# Altium schematic sheet Digital Port A.SchDoc: Port A Digital Control
size A4
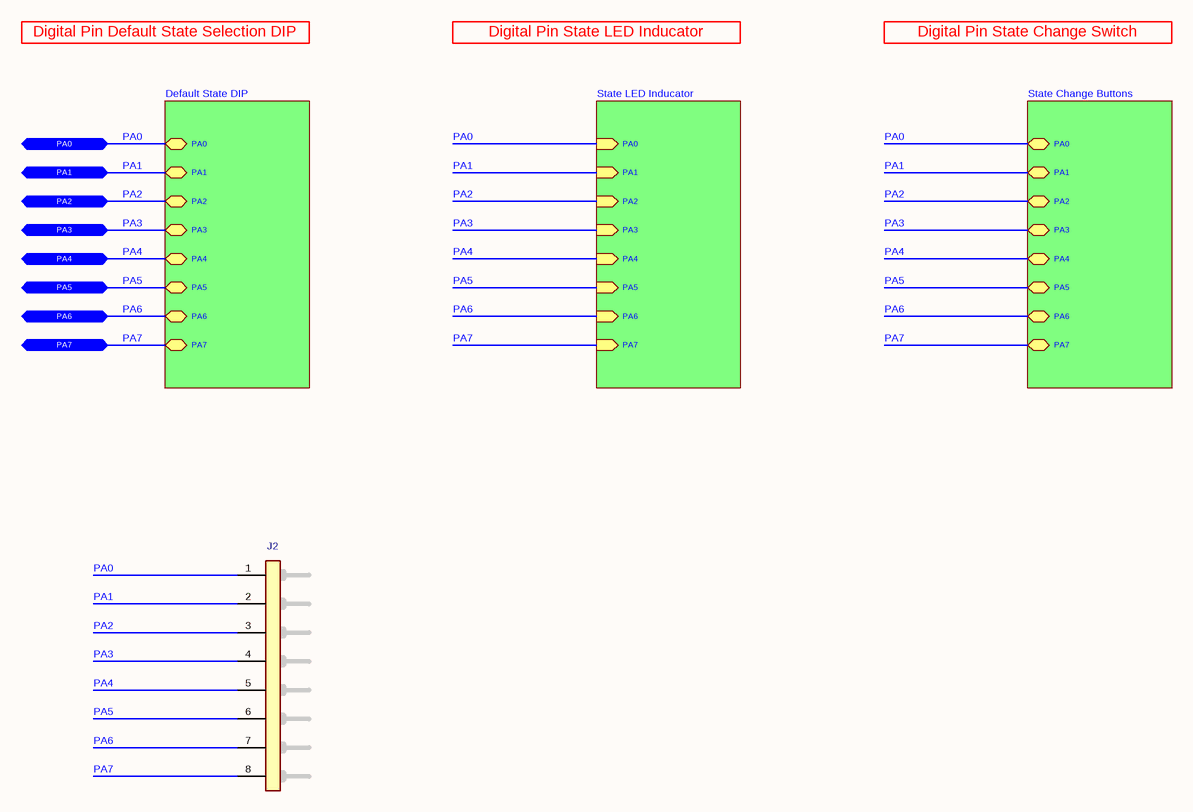
[diagram p0: Digital Port A.SchDoc]

## Parts
J2  2.54 mm Pitch 8P Male Connector  [8P Header]  (value not drawn)

## Sub-sheets
Default State DIP = Digital Port A Default State DIP.SchDoc: PA1 (bidir), PA0 (bidir), PA7 (bidir), PA4 (bidir), PA6 (bidir), PA3 (bidir), PA5 (bidir), PA2 (bidir)
State Change Buttons = Digital Port A Button.SchDoc: PA1 (bidir), PA0 (bidir), PA7 (bidir), PA4 (bidir), PA6 (bidir), PA3 (bidir), PA5 (bidir), PA2 (bidir)
State LED Inducator = Digital Port A State LED Inducator.SchDoc: PA1 (in), PA0 (in), PA7 (in), PA4 (in), PA6 (in), PA3 (in), PA5 (in), PA2 (in)

## Ports
PA0 (bidir), PA1 (bidir), PA2 (bidir), PA3 (bidir), PA4 (bidir), PA5 (bidir), PA6 (bidir), PA7 (bidir)

## Nets
PA0: J2.1(Pin-1) ; port PA0, sheet Default State DIP/PA0, sheet State LED Inducator/PA0, sheet State Change Buttons/PA0
PA1: J2.2(Pin-2) ; port PA1, sheet Default State DIP/PA1, sheet State LED Inducator/PA1, sheet State Change Buttons/PA1
PA2: J2.3(Pin-3) ; port PA2, sheet Default State DIP/PA2, sheet State LED Inducator/PA2, sheet State Change Buttons/PA2
PA3: J2.4(Pin-4) ; port PA3, sheet Default State DIP/PA3, sheet State LED Inducator/PA3, sheet State Change Buttons/PA3
PA4: J2.5(Pin-5) ; port PA4, sheet Default State DIP/PA4, sheet State LED Inducator/PA4, sheet State Change Buttons/PA4
PA5: J2.6(Pin-6) ; port PA5, sheet Default State DIP/PA5, sheet State LED Inducator/PA5, sheet State Change Buttons/PA5
PA6: J2.7(Pin-7) ; port PA6, sheet Default State DIP/PA6, sheet State LED Inducator/PA6, sheet State Change Buttons/PA6
PA7: J2.8(Pin-8) ; port PA7, sheet Default State DIP/PA7, sheet State LED Inducator/PA7, sheet State Change Buttons/PA7

## Notes on the sheet
- Digital Pin Default State Selection DIP
- Digital Pin State LED Inducator
- Digital Pin State Change Switch
- Title
- Size:
- Date:
- A4
- Number:
- Time:
- Revision:
- Sheet
- of
- File:

## Library data of the parts
J2 = Connector - Male Header 8P (2.54): Headers & Wire Housings BREAKAWAY HDR VERT 8; Manufacturer Name: Molex; Position: 8; Row: 1; Pitch: 2.54 mm; Manufacturer Part Number: 22-28-4083; Mouser Part Number: 538-22-28-4083; ROHS: Yes; ComponentLink1Description: DataSheet; ComponentLink1URL: https://www.mouser.com.tr/datasheet/2/276/0022284063_PCB_HEADERS-228265.pdf; ComponentLink2Description: Mouser; ComponentLink2URL: https://www.mouser.com.tr/ProductDetail/Molex/22-28-4083/?qs=%2Fha2pyFaduguMWEp6M%252Bj0x6fHxUvnRGD%252BIxBoa6MO5w%3D